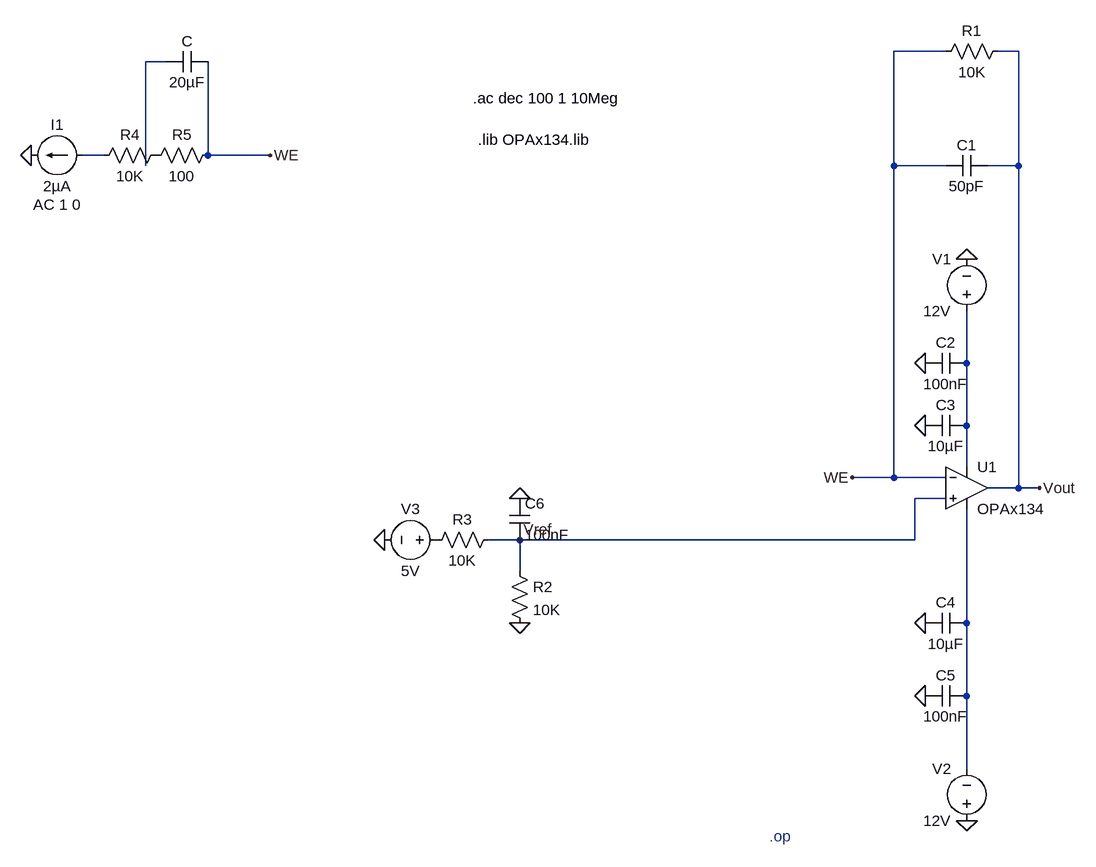
[diagram p0: schematic TIA_AC_STAB_2.asc]
TIA_AC_STAB_2.asc, the LTspice schematic file:
Version 4.1
SHEET 1 880 712
WIRE 128 -512 48 -512
WIRE 240 -512 208 -512
WIRE -1072 -496 -1104 -496
WIRE -1168 -352 -1200 -352
WIRE -1008 -352 -1008 -496
WIRE -912 -352 -1008 -352
WIRE -1104 -336 -1104 -496
WIRE 48 -336 48 -512
WIRE 128 -336 48 -336
WIRE 240 -336 240 -512
WIRE 240 -336 192 -336
WIRE 160 -32 160 -112
WIRE 160 64 160 -32
WIRE 160 128 160 64
WIRE 48 144 48 -336
WIRE 48 144 -16 144
WIRE 128 144 48 144
WIRE 240 160 240 -336
WIRE 240 160 192 160
WIRE 272 160 240 160
WIRE 128 176 80 176
WIRE -528 240 -576 240
WIRE 80 240 80 176
WIRE 80 240 -528 240
WIRE -528 288 -528 240
WIRE 160 368 160 192
WIRE 160 480 160 368
WIRE 160 592 160 480
FLAG 160 -192 0
FLAG 160 672 0
FLAG 96 -32 0
FLAG 96 64 0
FLAG 96 368 0
FLAG 96 480 0
FLAG -1280 -352 0
FLAG 272 160 Vout
FLAG -16 144 WE
FLAG -528 368 0
FLAG -528 176 0
FLAG -528 240 Vref
FLAG -736 240 0
FLAG -912 -352 WE
SYMBOL voltage 160 -96 R180
WINDOW 0 24 96 Left 2
WINDOW 3 24 16 Left 2
WINDOW 123 0 0 Left 0
WINDOW 39 0 0 Left 0
SYMATTR InstName V1
SYMATTR Value 12V
SYMBOL voltage 160 688 R180
WINDOW 0 24 96 Left 2
WINDOW 3 24 16 Left 2
WINDOW 123 0 0 Left 0
WINDOW 39 0 0 Left 0
SYMATTR InstName V2
SYMATTR Value 12V
SYMBOL cap 192 -352 R90
WINDOW 0 0 32 VBottom 2
WINDOW 3 32 32 VTop 2
SYMATTR InstName C1
SYMATTR Value 50pF
SYMBOL res 224 -528 R90
WINDOW 0 0 56 VBottom 2
WINDOW 3 32 56 VTop 2
SYMATTR InstName R1
SYMATTR Value 10K
SYMBOL cap 160 -48 R90
WINDOW 0 0 32 VBottom 2
WINDOW 3 32 32 VTop 2
SYMATTR InstName C2
SYMATTR Value 100nF
SYMBOL cap 160 48 R90
WINDOW 0 0 32 VBottom 2
WINDOW 3 32 32 VTop 2
SYMATTR InstName C3
SYMATTR Value 10µF
SYMBOL cap 160 352 R90
WINDOW 0 0 32 VBottom 2
WINDOW 3 32 32 VTop 2
SYMATTR InstName C4
SYMATTR Value 10µF
SYMBOL cap 160 464 R90
WINDOW 0 0 32 VBottom 2
WINDOW 3 32 32 VTop 2
SYMATTR InstName C5
SYMATTR Value 100nF
SYMBOL current -1200 -352 R90
WINDOW 0 -32 40 VBottom 2
WINDOW 3 32 40 VTop 2
WINDOW 123 60 40 VTop 2
WINDOW 39 0 0 Left 0
SYMATTR InstName I1
SYMATTR Value 2µA
SYMATTR Value2 AC 1 0
SYMBOL res -544 272 R0
SYMATTR InstName R2
SYMATTR Value 10K
SYMBOL res -560 224 R90
WINDOW 0 0 56 VBottom 2
WINDOW 3 32 56 VTop 2
SYMATTR InstName R3
SYMATTR Value 10K
SYMBOL voltage -640 240 R90
WINDOW 0 -32 56 VBottom 2
WINDOW 3 32 56 VTop 2
WINDOW 123 0 0 Left 0
WINDOW 39 0 0 Left 0
SYMATTR InstName V3
SYMATTR Value 5V
SYMBOL cap -544 176 R0
SYMATTR InstName C6
SYMATTR Value 100nF
SYMBOL res -1072 -368 R90
WINDOW 0 0 56 VBottom 2
WINDOW 3 32 56 VTop 2
SYMATTR InstName R4
SYMATTR Value 10K
SYMBOL res -992 -368 R90
WINDOW 0 0 56 VBottom 2
WINDOW 3 32 56 VTop 2
SYMATTR InstName R5
SYMATTR Value 100
SYMBOL cap -1008 -512 R90
WINDOW 0 0 32 VBottom 2
WINDOW 3 32 32 VTop 2
SYMATTR InstName C
SYMATTR Value 20µF
SYMBOL OpAmps\\opamp2 160 96 R0
SYMATTR InstName U1
SYMATTR Value OPAx134
TEXT -144 696 Left 2 ;.op
TEXT -600 -440 Left 2 !.ac dec 100 1 10Meg
TEXT -592 -376 Left 2 !.lib OPAx134.lib

The netlist it stands for:
* TIA_AC_STAB_2.asc
V1 N003 0 12V
V2 0 N004 12V
C1 Vout WE 50pF
R1 Vout WE 10K
C2 N003 0 100nF
C3 N003 0 10µF
C4 N004 0 10µF
C5 N004 0 100nF
I1 N002 0 2µA AC 1 0
R2 Vref 0 10K
R3 Vref P001 10K
V3 P001 0 5V
C6 0 Vref 100nF
R4 P002 N002 10K
R5 WE P002 100
C WE N001 20µF
X§U1 Vref WE N003 N004 Vout OPAx134  ; pins In+ In- V+ V- OUT
* .op
.ac dec 100 1 10Meg
.lib OPAx134.lib
.backanno
.end